# Altium schematic sheet PopAudio.SchDoc
size A
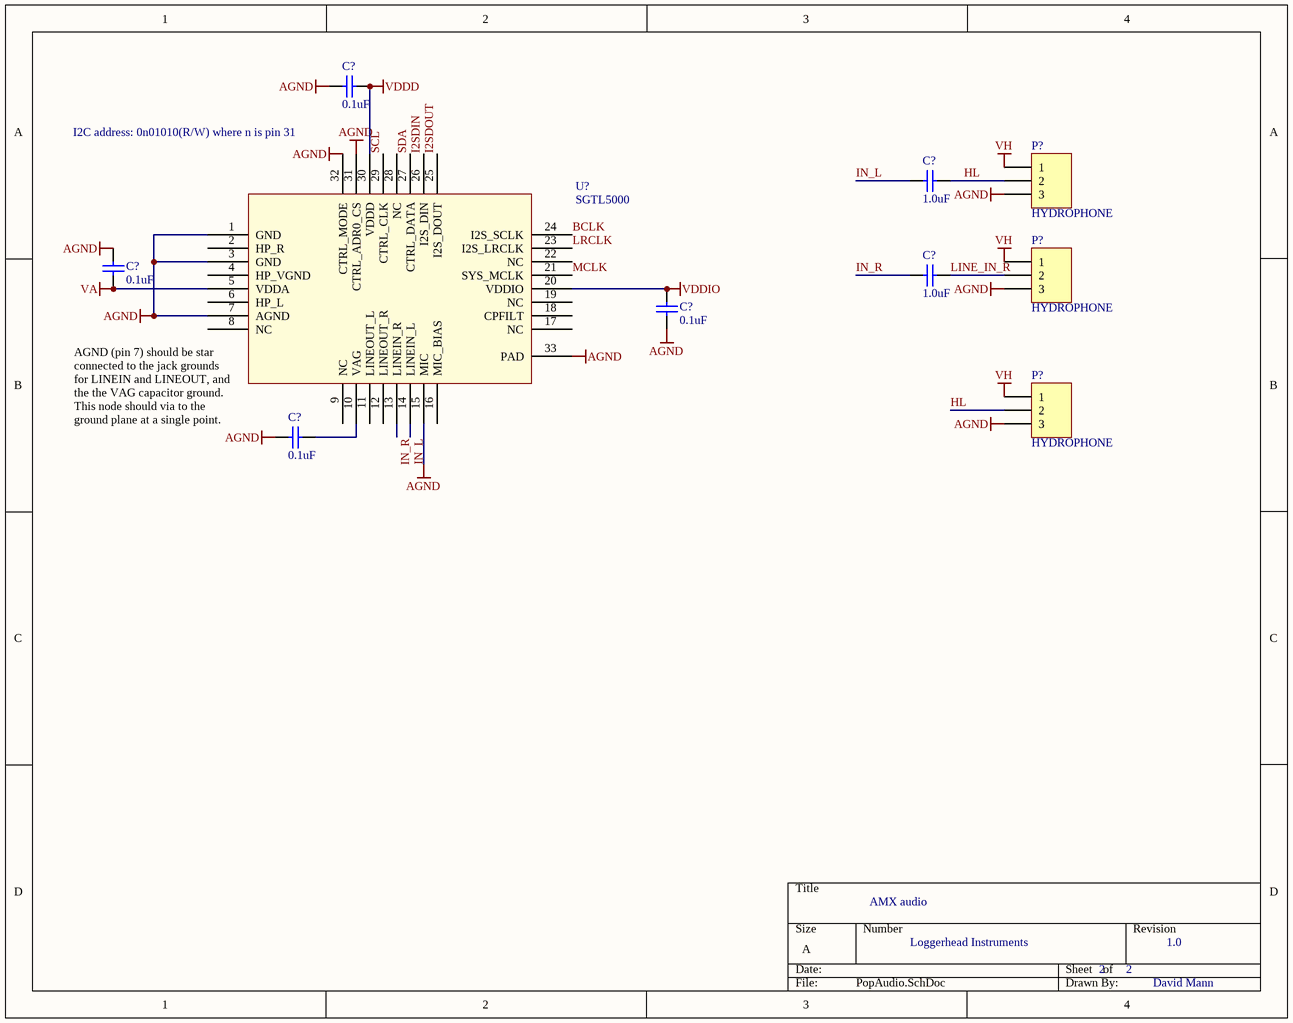
[diagram p0: PopAudio.SchDoc]

## Parts
(Parts that share a designator on the sheet are numbered #1, #2 ... from top to bottom, then left to right.)
C?#1  0.1uF  [0402]
C?#2  1.0uF  [0402]
C?#3  0.1uF  [0402]
C?#4  1.0uF  [0402]
C?#5  0.1uF  [0402]
C?#6  0.1uF  [0402]
P?#1  HYDROPHONE  [HDR1X3]
P?#2  HYDROPHONE  [HDR1X3]
P?#3  HYDROPHONE  [HDR1X3]
U?  SGTL5000  [QFN32]

## Nets
AGND: C?#1.2 C?#3.2 C?#5.2 C?#6.2 P?#1.3 P?#2.3 P?#3.3 U?.1(GND) U?.3(GND) U?.7(AGND) U?.15(MIC) U?.31(CTRL_ADR0_CS) U?.32(CTRL_MODE) U?.33(PAD)
VA: C?#3.1 U?.5(VDDA)
VDDD: C?#1.1 U?.30(VDDD)
VDDIO: C?#5.1 U?.20(VDDIO)
VH: P?#1.1 P?#2.1 P?#3.1
BCLK: U?.24(I2S_SCLK)
HL: C?#2.1 P?#1.2 P?#3.2
I2SDIN: U?.26(I2S_DIN)
I2SDOUT: U?.25(I2S_DOUT)
IN_L: C?#2.2 U?.14(LINEIN_L)
IN_R: C?#4.2 U?.13(LINEIN_R)
LINE_IN_R: C?#4.1 P?#2.2
LRCLK: U?.23(I2S_LRCLK)
MCLK: U?.21(SYS_MCLK)
SCL: U?.29(CTRL_CLK)
SDA: U?.27(CTRL_DATA)
NetC?#6_1: C?#6.1 U?.10(VAG)

Not connected (* = marked no-connect by the designer): U? 2(HP_R) 4(HP_VGND) 6(HP_L) 8(NC) 9(NC) 11(LINEOUT_L) 12(LINEOUT_R) 16(MIC_BIAS) 17(NC) 18(CPFILT) 19(NC) 22(NC) 28(NC)

## Notes on the sheet
- I2C address: 0n01010(R/W) where n is pin 31
- (near U?) AGND (pin 7) should be star connected to the jack grounds for LINEIN and LINEOUT, and the the VAG capacitor ground. This node should via to the ground plane at a single point.
- AMX audio
- Loggerhead Instruments
- 2
- 1.0
- David Mann

## Library data of the parts
C?#1 C?#3 C?#5 C?#6 = C0402: Ceramic Chip Capacitor - Standard; Note: Footprint corresponds to dimensions for bulk cassette packaging. This case size has tightened tolerances.; Published: 17-Jul-2002; LatestRevisionDate: 19-Mar-2004; LatestRevisionNote: Silkscreen size reduced.; DatasheetDocument: Mar-2001; PackageDocument: Mar-2001; PackageReference: 0402; Publisher: Altium Limited; Code_JEITA: 0402; Code_IPC: 1005 [0402]; ComponentLink1Description: Manufacturer Link; ComponentLink1URL: http://www.kemet.com/; ComponentLink2Description: Datasheet; ComponentLink2URL: http://www.kemet.com/kemet/web/homepage/kechome.nsf/vapubfilesname/F3102TA.pdf/$file/F3102TA.pdf; Value: 0.1uF
C?#2 C?#4 = C0402: Ceramic Chip Capacitor - Standard; Note: Footprint corresponds to dimensions for bulk cassette packaging. This case size has tightened tolerances.; Value: 0.1uF; Published: 17-Jul-2002; LatestRevisionDate: 19-Mar-2004; LatestRevisionNote: Silkscreen size reduced.; DatasheetDocument: Mar-2001; PackageDocument: Mar-2001; PackageReference: 0402; Publisher: Altium Limited; Code_JEITA: 0402; Code_IPC: 1005 [0402]; ComponentLink1Description: Manufacturer Link; ComponentLink1URL: http://www.kemet.com/; ComponentLink2Description: Datasheet; ComponentLink2URL: http://www.kemet.com/kemet/web/homepage/kechome.nsf/vapubfilesname/F3102TA.pdf/$file/F3102TA.pdf
P?#1-P?#3 = Header 3: Header, 3-Pin; LatestRevisionDate: 17-Jul-2002; LatestRevisionNote: Re-released for DXP Platform.; Publisher: Altium Limited